# EAGLE design RB1_v2 (EAGLE 6.5.0)
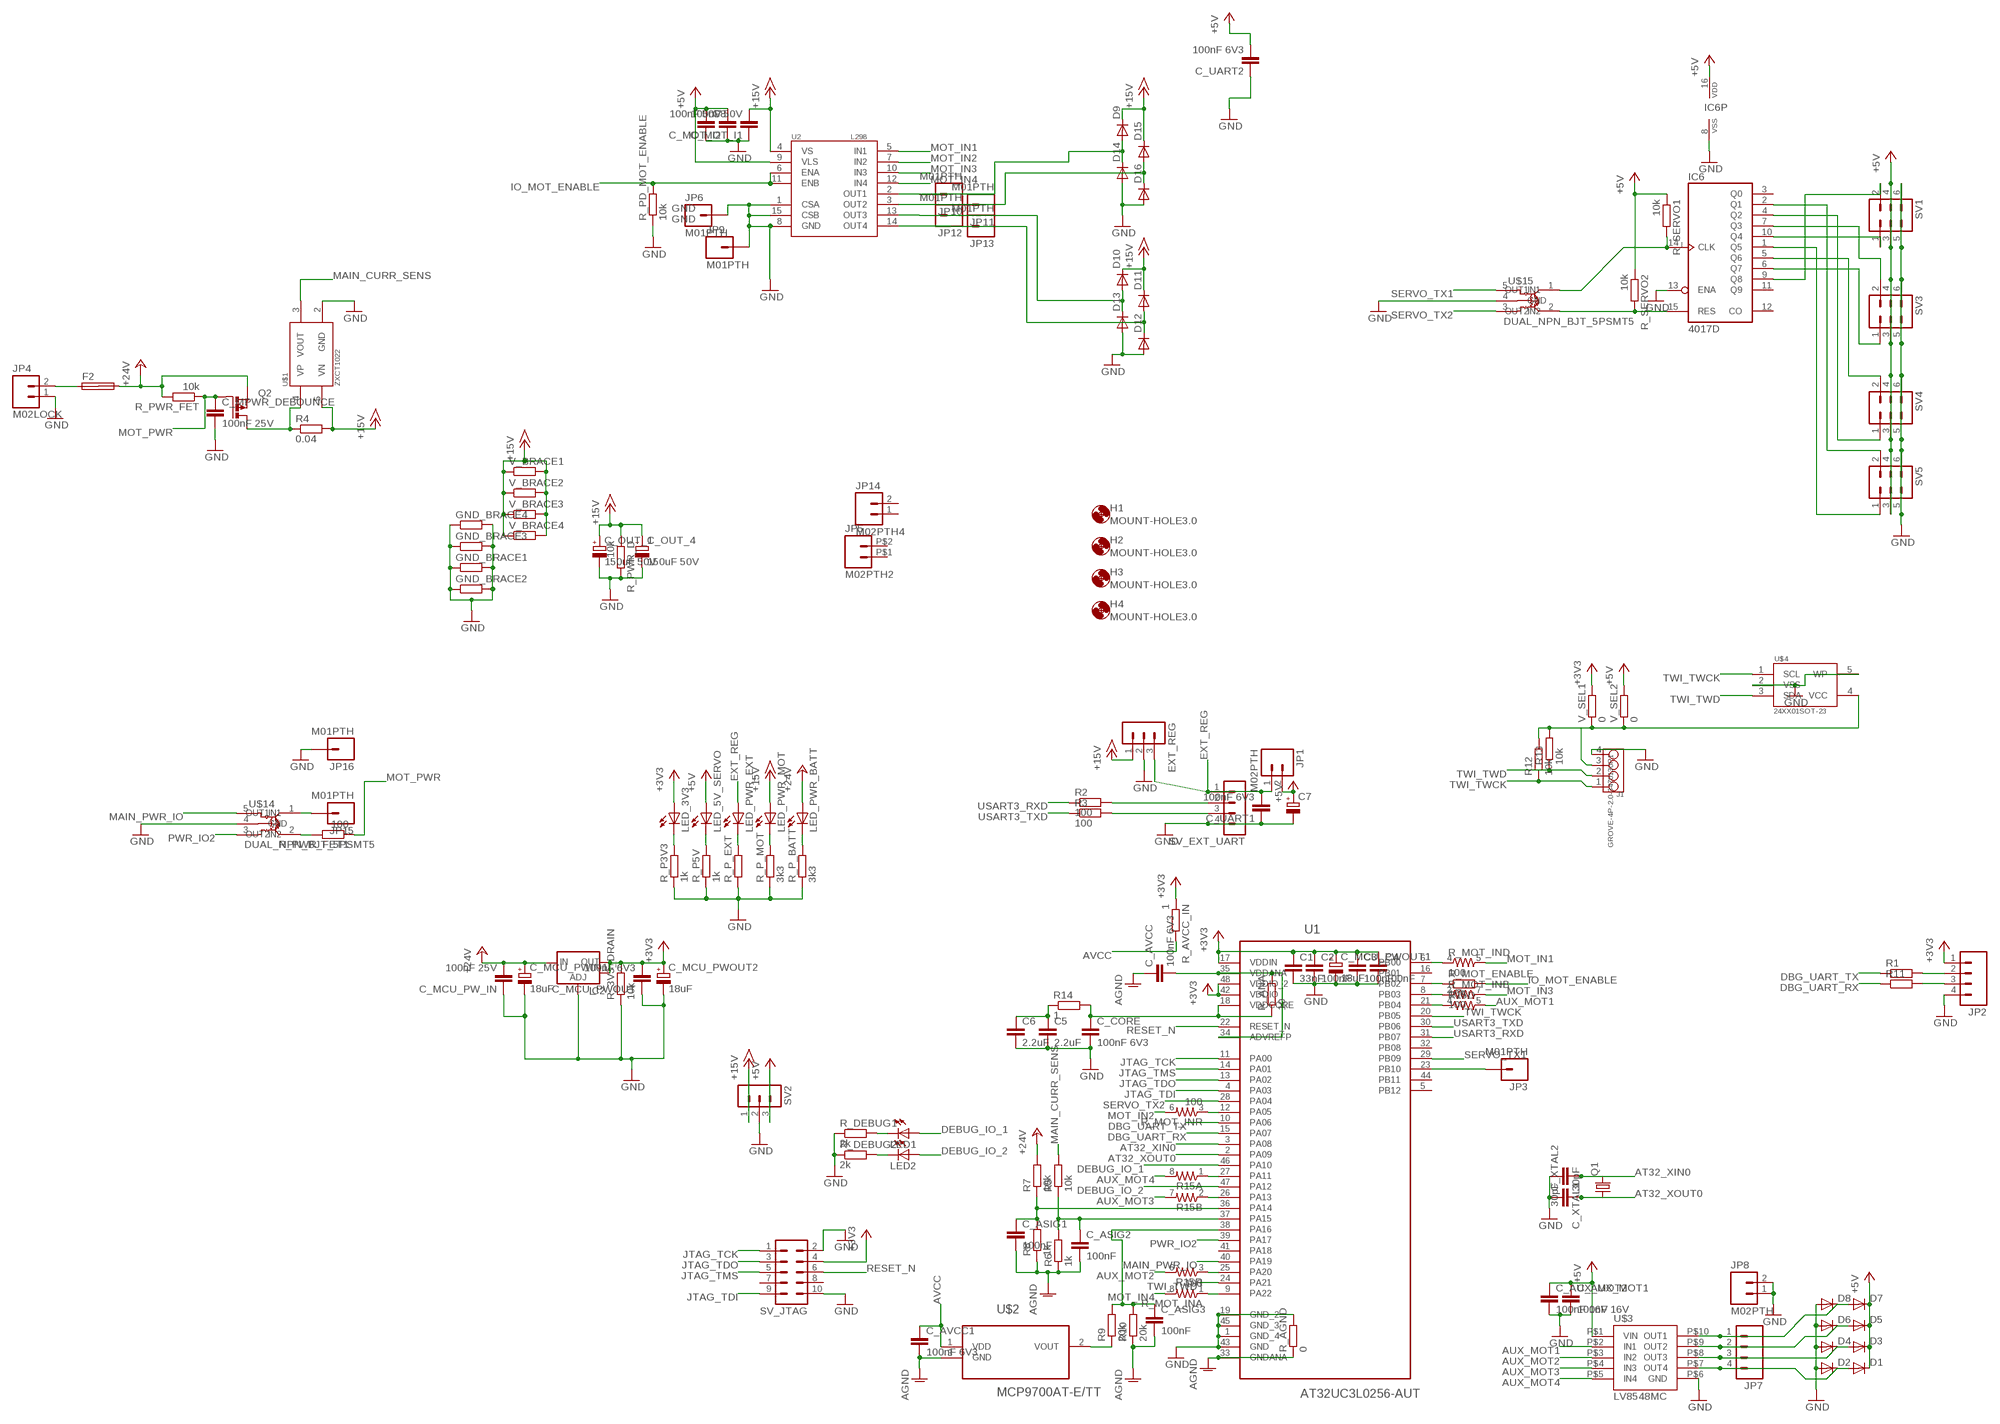
[diagram p0: schematic, sheet 1]

## Parts
C1  33nF  C-EUC0603K  [C0603K]
C2  100nF  C-EUC0603K  [C0603K]
C3  100nF  C-EUC0603K  [C0603K]
C4  100nF  C-EUC0603K  [C0603K]
C5  2.2uF  C-EUC0603K  [C0603K]
C6  2.2uF  C-EUC0603K  [C0603K]
C7  CPOL-EU153CLV-0807  [153CLV-0807]
C8  C-EUC1210K  [C1210K]
C_ASIG1  100nF  C-EUC0603K  [C0603K]
C_ASIG2  100nF  C-EUC0603K  [C0603K]
C_ASIG3  100nF  C-EUC0603K  [C0603K]
C_AUX_MOT1  100nF 16V  C-EUC0603K  [C0603K]
C_AUX_MOT2  100nF 16V  C-EUC0603K  [C0603K]
C_AVCC  100nF 6V3  C-EUC0603K  [C0603K]
C_AVCC1  100nF 6V3  C-EUC0603K  [C0603K]
C_CORE  100nF 6V3  C-EUC0603K  [C0603K]
C_MCU_PW_IN  100nF 25V  C-EUC0603K  [C0603K]
C_MCU_PWIN1  18uF  CPOL-EUE2-5  [E2-5]
C_MCU_PWOUT  100nF 6V3  C-EUC0603K  [C0603K]
C_MCU_PWOUT1  18uF  CPOL-EUE2-5  [E2-5]
C_MCU_PWOUT2  18uF  CPOL-EUE2-5  [E2-5]
C_MOT_I1  100nF 50V  C-EUC0603K  [C0603K]
C_MOT_I2  100nF 50V  C-EUC0603K  [C0603K]
C_MPWR_DEBOUNCE  100nF 25V  C-EUC0603K  [C0603K]
C_OUT_1  150uF 50V  CPOL-EUE5-10.5  [E5-10,5]
C_OUT_4  150uF 50V  CPOL-EUE5-10.5  [E5-10,5]
C_UART1  100nF 6V3  C-EUC0603K  [C0603K]
C_UART2  100nF 6V3  C-EUC0603K  [C0603K]
C_XTAL1  30pF  C-EUC0603K  [C0603K]
C_XTAL2  30pF  C-EUC0603K  [C0603K]
D1  DIODE-SOD123  [SOD123]
D2  DIODE-SOD123  [SOD123]
D3  DIODE-SOD123  [SOD123]
D4  DIODE-SOD123  [SOD123]
D5  DIODE-SOD123  [SOD123]
D6  DIODE-SOD123  [SOD123]
D7  DIODE-SOD123  [SOD123]
D8  DIODE-SOD123  [SOD123]
D9  DIODE-SOD123  [SOD123]
D10  DIODE-SOD123  [SOD123]
D11  DIODE-SOD123  [SOD123]
D12  DIODE-SOD123  [SOD123]
D13  DIODE-SOD123  [SOD123]
D14  DIODE-SOD123  [SOD123]
D15  DIODE-SOD123  [SOD123]
D16  DIODE-SOD123  [SOD123]
EXT_REG  MA03-1  [MA03-1]
F2  SHK20Q  [SHK20Q]
GND_BRACE1  R-EU_0204/2V  [0204V]
GND_BRACE2  R-EU_0204/2V  [0204V]
GND_BRACE3  R-EU_0204/2V  [0204V]
GND_BRACE4  R-EU_0204/2V  [0204V]
H1  MOUNT-HOLE3.0  [3,0]
H2  MOUNT-HOLE3.0  [3,0]
H3  MOUNT-HOLE3.0  [3,0]
H4  MOUNT-HOLE3.0  [3,0]
IC2  V_REG_LM1117SOT223  [SOT223]
IC6  4017D  [SO16]
J1  GROVE-4P-2.0-3470130P1  [4P-2.0]
JP1  M02PTH  [1X02]
JP2  M04PTH  [1X04]
JP3  M01PTH  [1X01]
JP4  M02LOCK  [1X02_LOCK]
JP5  M02PTH2  [1X02_BIG]
JP6  M01PTH  [1X01]
JP7  M04PTH  [1X04]
JP8  M02PTH  [1X02]
JP9  M01PTH  [1X01]
JP10  M01PTH  [1X01]
JP11  M01PTH  [1X01]
JP12  M01PTH  [1X01]
JP13  M01PTH  [1X01]
JP14  M02PTH4  [1X02_XTRA_BIG]
JP15  M01PTH  [1X01]
JP16  M01PTH  [1X01]
LED1  LEDCHIPLED_0603  [CHIPLED_0603]
LED2  LEDCHIPLED_0603  [CHIPLED_0603]
LED_3V3  LEDSML0603  [SML0603]
LED_5V_SERVO  LEDSML0603  [SML0603]
LED_PWR_BATT  LEDSML0603  [SML0603]
LED_PWR_EXT  LEDSML0603  [SML0603]
LED_PWR_MOT  LEDSML0603  [SML0603]
Q1  CRYSTALHC49S  [HC49/S]
Q2  P-MOSFET-SO8  [SO-08]
R1  R-EU_R0603  [R0603]
R2  100  R-EU_R0603  [R0603]
R3  100  R-EU_R0603  [R0603]
R4  0.04  R-EU_0617/17  [0617/17]
R5  10k  R-EU_R0603  [R0603]
R6  1k  R-EU_R0603  [R0603]
R7  10k  R-EU_R0603  [R0603]
R8  1k  R-EU_R0603  [R0603]
R9  20k  R-EU_R0603  [R0603]
R10  20k  R-EU_R0603  [R0603]
R11  R-EU_R0603  [R0603]
R12  10k  R-EU_R0603  [R0603]
R13  10k  R-EU_R0603  [R0603]
R14  1  R-EU_R0603  [R0603]
R15  RESISTOR-ARRAY0603-ARV  [0603-ARV]
R_3V3_DRAIN  10k  R-EU_R0603  [R0603]
R_AGND  0  R-EU_R0603  [R0603]
R_ANA  10  R-EU_R0603  [R0603]
R_AVCC_IN  1  R-EU_R0603  [R0603]
R_DEBUG1  2k  R-EU_R0603  [R0603]
R_DEBUG2  2k  R-EU_R0603  [R0603]
R_MOT_ENABLE  100  R-EU_R0603  [R0603]
R_MOT_IN  100  RESISTOR-ARRAY0603-ARV  [0603-ARV]
R_P3V3  1k  R-EU_R0603  [R0603]
R_P5V  1k  R-EU_R0603  [R0603]
R_P_BATT  3k3  R-EU_R0603  [R0603]
R_P_EXT  R-EU_R0603  [R0603]
R_P_MOT  3k3  R-EU_R0603  [R0603]
R_PD_MOT_ENABLE  10k  R-EU_R0603  [R0603]
R_PWR_D  10k  R-EU_R0603  [R0603]
R_PWR_FET  10k  R-EU_R0603  [R0603]
R_PWR_FET1  100  R-EU_R0603  [R0603]
R_SERVO1  10k  R-EU_R0603  [R0603]
R_SERVO2  10k  R-EU_R0603  [R0603]
SV1  MA03-2  [MA03-2]
SV2  MA03-1  [MA03-1]
SV3  MA03-2  [MA03-2]
SV4  MA03-2  [MA03-2]
SV5  MA03-2  [MA03-2]
SV_EXT_UART  MA04-1  [MA04-1]
SV_JTAG  MA05-2  [MA05-2]
U1  AT32UC3L0256-AUT  [QFP50P900X900X120-48N]
U2  L298  [MULTIWATT15]
U$1  ZXCT1022  [SOT23-5]
U$2  MCP9700AT-E/TT  [SOT95P237X112-3N]
U$3  LV8548MC  [SOIC10]
U$4  24XX01SOT-23  [SOT23-5L]
U$14  DUAL_NPN_BJT_5PSMT5  [SC-74A]
U$15  DUAL_NPN_BJT_5PSMT5  [SC-74A]
V_BRACE1  R-EU_0204/2V  [0204V]
V_BRACE2  R-EU_0204/2V  [0204V]
V_BRACE3  R-EU_0204/2V  [0204V]
V_BRACE4  R-EU_0204/2V  [0204V]
V_SEL1  0  R-EU_R0603  [R0603]
V_SEL2  0  R-EU_R0603  [R0603]

## Nets
+3V3: C1.1 C2.1 C3.1 C4.1 C_MCU_PWOUT1.+ C_MCU_PWOUT2.+ C_MCU_PWOUT.2 IC2.2(OUT) IC2.4(OUT) JP2.1 LED_3V3.A R_3V3_DRAIN.2 R_AVCC_IN.1 SV_JTAG.4 U1.17(VDDIN) U1.42(VDDIO) U1.48(VDDIO_2) V_SEL1.2
+5V: C7.+ C8.1 C_AUX_MOT1.1 C_AUX_MOT2.1 C_MOT_I2.2 C_UART2.2 D1.C D3.C D5.C D7.C IC6.16(VDD) JP1.2 LED_5V_SERVO.A R_SERVO1.1 R_SERVO2.1 SV1.3 SV1.4 SV2.3 SV3.3 SV3.4 SV4.3 SV4.4 SV5.3 SV5.4 U2.9(VLS) U$3.P$1(VIN) V_SEL2.2
+15V: C_MOT_I1.2 C_OUT_1.+ C_OUT_4.+ D9.C D10.C D11.C D15.C EXT_REG.1 LED_PWR_MOT.A R4.2 R_PWR_D.1 SV2.1 U2.4(VS) U$1.5(VN) V_BRACE1.1 V_BRACE1.2 V_BRACE2.1 V_BRACE2.2 V_BRACE3.1 V_BRACE3.2 V_BRACE4.1 V_BRACE4.2
+24V: C_MCU_PW_IN.2 C_MCU_PWIN1.+ F2.2A IC2.3(IN) LED_PWR_BATT.A Q2.1(S) Q2.2(S) Q2.3(S) R7.2 R_PWR_FET.2
AGND: C_ASIG1.2 C_ASIG2.2 C_ASIG3.2 C_AVCC1.2 C_AVCC.1 R6.1 R8.1 R10.1 R_AGND.1 U1.33(GNDANA) U$2.3(GND)
AT32_XIN0: C_XTAL1.1 Q1.2 U1.3(PA08)
AT32_XOUT0: C_XTAL2.2 Q1.1 U1.2(PA09)
AUX_MOT1: R15.5 U$3.P$2(IN1)
AUX_MOT2: R15.6 U$3.P$3(IN2)
AUX_MOT3: R15.7 U$3.P$4(IN3)
AUX_MOT4: R15.8 U$3.P$5(IN4)
AVCC: C_AVCC1.1 R_AVCC_IN.2 U$2.1(VDD)
BATT_VOLT_SENS: Q2.5(D) Q2.6(D) Q2.7(D) Q2.8(D) R4.1 U$1.4(VP)
DBG_UART_RX: R11.1 U1.15(PA07)
DBG_UART_TX: R1.1 U1.10(PA06)
DEBUG_IO_1: LED1.A U1.46(PA10)
DEBUG_IO_2: LED2.A U1.47(PA12)
EXT_REG: C_UART1.2 EXT_REG.3 JP1.1 LED_PWR_EXT.A SV_EXT_UART.1
GND: C1.2 C2.2 C3.2 C4.2 C5.2 C6.2 C7.- C8.2 C_AUX_MOT1.2 C_AUX_MOT2.2 C_CORE.2 C_MCU_PW_IN.1 C_MCU_PWIN1.- C_MCU_PWOUT1.- C_MCU_PWOUT2.- C_MCU_PWOUT.1 C_MOT_I1.1 C_MOT_I2.1 C_MPWR_DEBOUNCE.2 C_OUT_1.- C_OUT_4.- C_UART1.1 C_UART2.1 C_XTAL1.2 C_XTAL2.1 D2.A D4.A D6.A D8.A D12.A D13.A D14.A D16.A EXT_REG.2 GND_BRACE1.1 GND_BRACE1.2 GND_BRACE2.1 GND_BRACE2.2 GND_BRACE3.1 GND_BRACE3.2 GND_BRACE4.1 GND_BRACE4.2 IC2.1(ADJ) IC6.8(VSS) IC6.13(ENA) J1.4 JP2.4 JP4.1 JP6.1 JP8.1 JP8.2 JP9.1 JP16.1 R_3V3_DRAIN.1 R_AGND.2 R_DEBUG1.1 R_DEBUG2.1 R_P3V3.1 R_P5V.1 R_P_BATT.1 R_P_EXT.1 R_P_MOT.1 R_PD_MOT_ENABLE.1 R_PWR_D.2 SV1.5 SV1.6 SV2.2 SV3.5 SV3.6 SV4.5 SV4.6 SV5.5 SV5.6 SV_EXT_UART.4 SV_JTAG.2 SV_JTAG.10 U1.1(GND_4) U1.19(GND_2) U1.43(GND) U1.45(GND_3) U2.1(CSA) U2.8(GND) U2.15(CSB) U$1.2(GND) U$3.P$6(GND) U$4.2(VSS) U$4.5(WP) U$14.4(GND) U$15.4(GND)
IO_MOT_ENABLE: R_MOT_ENABLE.2 R_PD_MOT_ENABLE.2 U2.6(ENA) U2.11(ENB)
JTAG_TCK: SV_JTAG.1 U1.11(PA00)
JTAG_TDI: SV_JTAG.9 U1.4(PA03)
JTAG_TDO: SV_JTAG.3 U1.13(PA02)
JTAG_TMS: SV_JTAG.5 U1.14(PA01)
MAIN_CURR_SENS: R5.2 U$1.3(VOUT)
MAIN_PWR_IO: U1.40(PA19) U$14.5(IN1)
MOT_IN1: R_MOT_IN.5 U2.5(IN1)
MOT_IN2: R_MOT_IN.6 U2.7(IN2)
MOT_IN3: R_MOT_IN.7 U2.10(IN3)
MOT_IN4: R_MOT_IN.8 U2.12(IN4)
MOT_O3_1: D11.A D12.C JP13.1 U2.14(OUT4)
MOT_O3_2: D10.A D13.C JP12.1 U2.13(OUT3)
MOT_O4_1: D15.A D16.C JP11.1 U2.3(OUT2)
MOT_O4_2: D9.A D14.C JP10.1 U2.2(OUT1)
MOT_PWR: C_MPWR_DEBOUNCE.1 Q2.4(G) R_PWR_FET1.1 R_PWR_FET.1
N$1: C_AVCC.2 R_ANA.2 U1.34(ADVREFP) U1.35(VDDANA)
N$2: R9.1 U$2.2(VOUT)
N$3: R_MOT_IN.4 U1.6(PB00)
N$4: R_MOT_IN.3 U1.12(PA05)
N$5: IC6.14(CLK) R_SERVO1.2 U$15.1(OUT1)
N$6: IC6.15(RES) R_SERVO2.2 U$15.2(OUT2)
N$7: R_PWR_FET1.2 U$14.2(OUT2)
N$8: R_MOT_IN.2 U1.8(PB03)
N$9: F2.1A JP4.2
N$10: J1.3 R12.2 R13.2 U$4.4(VCC) V_SEL1.1 V_SEL2.1
N$11: R_MOT_IN.1 U1.9(PA22)
N$12: LED_3V3.C R_P3V3.2
N$13: IC6.1(Q5) SV5.1
N$14: C5.1 C6.1 R14.1
N$15: IC6.2(Q1) SV5.2
N$16: C_ASIG3.1 R9.2 R10.2 U1.38(PA16)
N$17: IC6.4(Q2) SV4.1
N$18: D7.A D8.C JP7.1 U$3.P$10(OUT1)
N$19: IC6.5(Q6) SV4.2
N$20: LED_5V_SERVO.C R_P5V.2
N$21: LED_PWR_EXT.C R_P_EXT.2
N$22: LED_PWR_MOT.C R_P_MOT.2
N$23: IC6.6(Q7) SV3.1
N$24: IC6.7(Q3) SV3.2
N$25: C_ASIG1.1 R7.1 R8.2 U1.36(PA14)
N$26: C_ASIG2.1 R5.1 R6.2 U1.37(PA15)
N$27: IC6.9(Q8) SV1.2
N$28: LED_PWR_BATT.C R_P_BATT.2
N$29: D5.A D6.C JP7.2 U$3.P$9(OUT2)
N$30: D3.A D4.C JP7.3 U$3.P$8(OUT3)
N$31: D1.A D2.C JP7.4 U$3.P$7(OUT4)
N$32: IC6.10(Q4) SV1.1
N$33: JP2.3 R11.2
N$34: JP2.2 R1.2
N$35: R_MOT_ENABLE.1 U1.7(PB02)
N$36: JP3.1 U1.23(PB10)
N$37: R15.4 U1.21(PB04)
N$38: R15.3 U1.25(PA20)
N$39: R15.2 U1.26(PA13)
N$40: R15.1 U1.27(PA11)
N$41: JP15.1 U$14.1(OUT1)
N$42: LED1.C R_DEBUG1.2
N$43: LED2.C R_DEBUG2.2
N$44: C_CORE.1 R14.2 R_ANA.1 U1.18(VDDCORE)
PWR_IO2: U1.39(PA17) U$14.3(IN2)
RESET_N: SV_JTAG.6 U1.22(RESET_N)
SERVO_TX1: U1.29(PB09) U$15.5(IN1)
SERVO_TX2: U1.28(PA04) U$15.3(IN2)
TWI_TWCK: J1.1 R12.1 U1.20(PB05) U$4.1(SCL)
TWI_TWD: J1.2 R13.1 U1.24(PA21) U$4.3(SDA)
USART3_RXD: R2.1 U1.31(PB07)
USART3_RXD_2: R2.2 SV_EXT_UART.2
USART3_TXD: R3.1 U1.30(PB06)
USART3_TXD_2: R3.2 SV_EXT_UART.3
Unconnected: F2.1B F2.2B IC6.3(Q0) IC6.11(Q9) IC6.12(CO) JP5.P$1 JP5.P$2 JP14.1 JP14.2 SV_JTAG.7 SV_JTAG.8 U1.5(PB12) U1.16(PB01) U1.32(PB08) U1.41(PA18) U1.44(PB11)

## Library data of the parts
C1-C6 C8 C_ASIG1-C_ASIG3 C_AUX_MOT1 C_AUX_MOT2 C_AVCC C_AVCC1 C_CORE C_MCU_PW_IN C_MCU_PWOUT C_MOT_I1 C_MOT_I2 C_MPWR_DEBOUNCE C_UART1 C_UART2 C_XTAL1 C_XTAL2 = resistor:C-EU: CAPACITOR, European symbol
C7 C_MCU_PWIN1 C_MCU_PWOUT1 C_MCU_PWOUT2 C_OUT_1 C_OUT_4 = resistor:CPOL-EU: POLARIZED CAPACITOR, European symbol
D1-D16 = diode:DIODE-: DIODE
EXT_REG SV2 = con-lstb:MA03-1: PIN HEADER; OC_FARNELL: unknown; OC_NEWARK: unknown
F2 = fuse:SHK20Q: FUSE HOLDER 5 x 20 mm, SH contact, E1207 Buerklin 64G6061; OC_FARNELL: unknown; OC_NEWARK: unknown
GND_BRACE1-GND_BRACE4 R1-R14 R_3V3_DRAIN R_AGND R_ANA R_AVCC_IN R_DEBUG1 R_DEBUG2 R_MOT_ENABLE R_P3V3 R_P5V R_P_BATT R_P_EXT R_P_MOT R_PD_MOT_ENABLE R_PWR_D R_PWR_FET R_PWR_FET1 R_SERVO1 R_SERVO2 V_BRACE1-V_BRACE4 V_SEL1 V_SEL2 = resistor:R-EU_: RESISTOR, European symbol
H1-H4 = holes:MOUNT-HOLE: MOUNTING HOLE with drill center marker
IC2 = SparkFun-PowerIC:V_REG_LM1117: Voltage Regulator LM1117 Standard adjustable voltage regulator but in SMD form. Spark Fun Electronics SKU : COM-00595
IC6 = 40xx:4017: COUNTER/DIVIDER
J1 = OPLEagle:GROVE-4P-2.0
JP1 JP4 JP5 JP8 JP14 = SparkFun-Connectors:M02: Standard 2-pin 0.1" header. Use with - straight break away headers ( PRT-00116) - right angle break away headers (PRT-00553) - swiss pins (PRT-00743) - machine pins (PRT-00117) - female headers (PRT-00115) Molex polarized connector foot print use with: PRT-08233 with associated crimp pins and housings. 2.54_SCREWTERM for use with PRT-10571. 3.5mm Screw Terminal footprints for PRT-08084 5mm Screw Terminal footprints for use with PRT-08433
JP2 JP7 = SparkFun-Connectors:M04: Header 4 Standard 4-pin 0.1" header. Use with straight break away headers (SKU : PRT-00116), right angle break away headers (PRT-00553), swiss pins (PRT-00743), machine pins (PRT-00117), and female headers (PRT-00115). Molex polarized connector foot print use with SKU : PRT-08231 with associated crimp pins and housings. 1MM SMD Version SKU: PRT-10208
JP3 JP6 JP9-JP13 JP15 JP16 = SparkFun-Connectors:M01: Header 1 Standard 1-pin 0.1" header. Use with straight break away headers (SKU : PRT-00116), right angle break away headers (PRT-00553), swiss pins (PRT-00743), machine pins (PRT-00117), and female headers (PRT-00115).
LED1 LED2 LED_3V3 LED_5V_SERVO LED_PWR_BATT LED_PWR_EXT LED_PWR_MOT = led:LED: LED OSRAM: - CHIPLED LG R971, LG N971, LY N971, LG Q971, LY Q971, LO R971, LY R971 LH N974, LH R974 LS Q976, LO Q976, LY Q976 LO Q996 - Hyper CHIPLED LW Q18S LB Q993, LB Q99A, LB R99A - SideLED LS A670, LO A670, LY A670, LG A670, LP A670 LB A673, LV A673, LT A673, LW A673 LH A674 LY A675 LS A676, LA A676, LO A676, LY A676, LW A676 LS A679, LY A679, LG A679 - Hyper Micro SIDELED® LS Y876, LA Y876, LO Y876, LY Y876 LT Y87S - SmartLED LW L88C, LW L88S LB L89C, LB L89S, LG L890 LS L89K, LO L89K, LY L89K LS L896, LA L896, LO L896, LY L896 - TOPLED LS T670, LO T670, LY T670, LG T670, LP T670 LSG T670, LSP T670, LSY T670, LOP T670, LYG T670 LG T671, LOG T671, LSG T671 LB T673, LV T673, LT T673, LW T673 LH T674 LS T676, LA T676, LO T676, LY T676, LB T676, LH T676, LSB T676, LW T676 LB T67C, LV T67C, LT T67C, LS T67K, LO T67K, LY T67K, LW E67C LS E67B, LA E67B, LO E67B, LY E67B, LB E67C, LV E67C, LT E67C LW T67C LS T679, LY T679, LG T679 LS T770, LO T770, LY T770, LG T770, LP T770 LB T773, LV T773, LT T773, LW T773 LH T774 LS E675, LA E675, LY E675, LS T675 LS T776, LA T776, LO T776, LY T776, LB T776 LHGB T686 LT T68C, LB T68C - Hyper Mini TOPLED® LB M676 - Mini TOPLED Santana® LG M470 LS M47K, LO M47K, LY M47K Source: http://www.osram.convergy.de LUXEON: - LUMILED® LXK2-PW12-R00, LXK2-PW12-S00, LXK2-PW14-U00, LXK2-PW14-V00 LXK2-PM12-R00, LXK2-PM12-S00, LXK2-PM14-U00 LXK2-PE12-Q00, LXK2-PE12-R00, LXK2-PE12-S00, LXK2-PE14-T00, LXK2-PE14-U00 LXK2-PB12-K00, LXK2-PB12-L00, LXK2-PB12-M00, LXK2-PB14-N00, LXK2-PB14-P00, LXK2-PB14-Q00 LXK2-PR12-L00, LXK2-PR12-M00, LXK2-PR14-Q00, LXK2-PR14-R00 LXK2-PD12-Q00, LXK2-PD12-R00, LXK2-PD12-S00 LXK2-PH12-R00, LXK2-PH12-S00 LXK2-PL12-P00, LXK2-PL12-Q00, LXK2-PL12-R00 Source: www.luxeon.com KINGBRIGHT: KA-3528ASYC Source: www.kingbright.com
Q1 = crystal:CRYSTAL: CRYSTAL; OC_FARNELL: 1667008; OC_NEWARK: unknown
Q2 = transistor-power:P-MOSFET-SO8: P-Channel MOSFET Example: FDS4435A; P-Channel Logic Level PowerTrench® MOSFET FDS4465; P-Channel 1.8V Specified PowerTrench® MOSFET Source: www.fairchildsemi.com
R15 R_MOT_IN = SparkFun-Resistors:RESISTOR-ARRAY: Array Chip Resistor Source: RS Component / Phycomp
SV1 SV3-SV5 = con-lstb:MA03-2: PIN HEADER; OC_FARNELL: unknown; OC_NEWARK: unknown
SV_EXT_UART = con-lstb:MA04-1: PIN HEADER; OC_FARNELL: unknown; OC_NEWARK: unknown
SV_JTAG = con-lstb:MA05-2: PIN HEADER; OC_FARNELL: unknown; OC_NEWARK: unknown
U1 = jmsSwitches:AT32UC3L0256-AUT: MCU, 32BIT, 128K FLASH, TQFP-48; MPN: AT32UC3L0256-AUT; OC_FARNELL: 1972037; OC_NEWARK: 68T4614; PACKAGE: TQFP-48; SUPPLIER: ATMEL
U2 = SparkFun-PowerIC:L298: L298 Dual Full Bridge Driver
U$1 = jmsSwitches:ZXCT1022: High-side current sensor. Needs a resistor, e.g. 0.05Ohm. Out = 100 x VP - VN
U$2 = jmsSwitches:MCP9700AT-E/TT: Low-Power Linear Active Thermistor; MPN: MCP9700AT-E/TT; OC_FARNELL: 1605577; OC_NEWARK: 84R5199; PACKAGE: SOT-3; SUPPLIER: MICROCHIP
U$3 = jmsSwitches:LV8548MC: 1A Motor Driver
U$4 = jmsSwitches:24XX01: 1K I2C EEPROM by Microchip. Address is 1010xxx, where xxx is internal block address.
U$14 U$15 = jmsSwitches:DUAL_NPN_BJT_5P

## Board
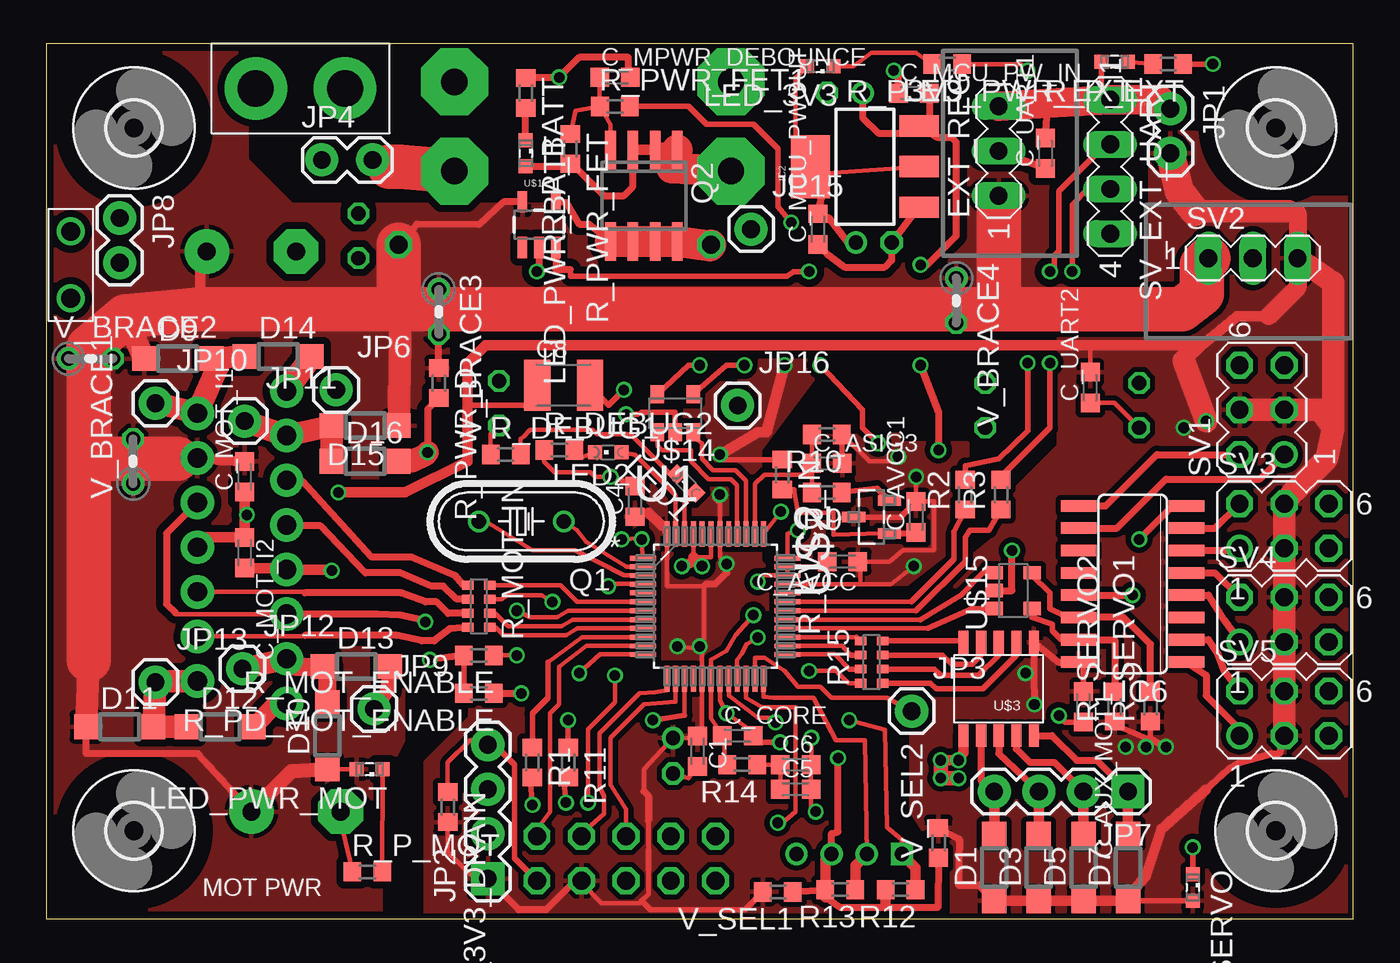
[diagram p1: board, top side]
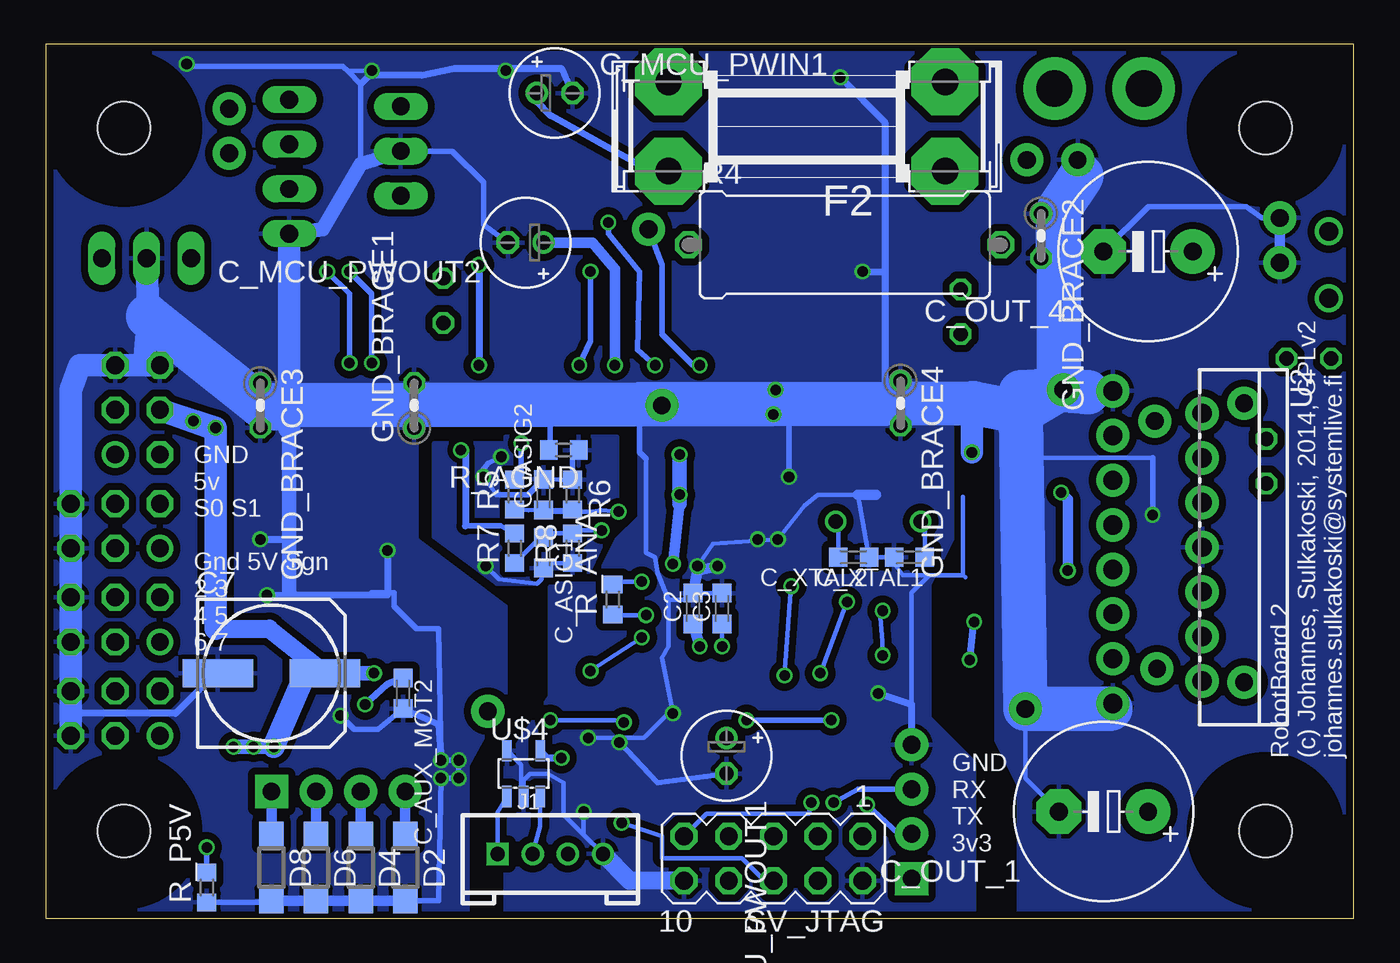
[diagram p2: board, bottom side, seen from below]

Size 74.42 x 49.78 mm. Coordinates in mm from the lower left corner, seen from the top.
Outline: 0,0 74.42,0 74.42,49.78 0,49.78 0,0
Copper layers (1*2*15*16): Top 0.035mm / dielectric 0.2mm / layer 2 0.0175mm / dielectric 1.1mm / layer 15 0.0175mm / dielectric 0.2mm / Bottom 0.035mm
Design rules "SeeedStudio_DRU_no_angle_20130527": minimum track width 6mil, minimum drill 12mil, track to track 6mil, track to pad 6mil, pad to pad 6mil, via to via 6mil, smd to smd 0mil, copper to edge 10mil, drill to drill 10mil, minimum pad ring 6mil, minimum via ring 6mil, stop-mask expansion 2mil, vias tented up to drill 25mil, thermal gap 10mil

### Footprints (pad centres in the part's own frame; a part is rotated, then mirrored left to right if it is on the bottom)
C0603K = smd 1.05 x 1.08: 1 -0.875,0; 2 0.875,0
153CLV-0807 = smd 4 x 1.6: + 3.05,0; - -3.05,0
C1210K = smd 1.5 x 2.9: 1 -1.5,0; 2 1.5,0
E2-5 = drill 0.813 pad 1.27: + -1.016,0 | drill 0.813 pad 1.27 octagon: - 1.016,0
E5-10,5 = drill 1.016 pad 2.54: + -2.54,0 | drill 1.016 pad 2.54 octagon: - 2.54,0
SOD123 = smd 1.4 x 1.4: A 1.9,0; C -1.9,0
MA03-1 = drill 1.016 long: 1 -2.54,0; 2 0,0; 3 2.54,0
SHK20Q = drill 1.5 pad 3.81 octagon: 1A -7.874,2.54; 1B -7.874,-2.54; 2A 7.874,2.54; 2B 7.874,-2.54
0204V = drill 0.813 octagon: 1 -1.27,0; 2 1.27,0
3,0 = hole 3: 0,0
SOT223 = smd 1.219 x 2.235: 1 -2.311,-3.099; 2 0,-3.099; 3 2.311,-3.099 | smd 3.6 x 2.2: 4 0,3.099
SO16 = smd 0.66 x 2.032: 1 -4.445,-3.073; 2 -3.175,-3.073; 3 -1.905,-3.073; 4 -0.635,-3.073; 5 0.635,-3.073; 6 1.905,-3.073; 7 3.175,-3.073; 8 4.445,-3.073; 9 4.445,3.073; 10 3.175,3.073; 11 1.905,3.073; 12 0.635,3.073; 13 -0.635,3.073; 14 -1.905,3.073; 15 -3.175,3.073; 16 -4.445,3.073
4P-2.0 = drill 0.8 pad 1.27 square: 1 -3,0 | drill 0.8 pad 1.27: 2 -1,0; 3 1,0; 4 3,0
1X02 = drill 1.016 pad 1.88: 1 0,0; 2 2.54,0
1X04 = drill 1.016 pad 1.88 square: 1 0,0 | drill 1.016 pad 1.88: 2 2.54,0; 3 5.08,0; 4 7.62,0
1X01 = drill 1.016 pad 1.88: 1 0,0
1X02_LOCK = drill 1.016 pad 1.88: 1 -0.178,0; 2 2.718,0
1X02_BIG = drill 1.067: P$1 0,0; P$2 3.81,0
1X02_XTRA_BIG = drill 2.057 pad 3.556: 1 -2.54,0; 2 2.54,0
CHIPLED_0603 = smd 0.8 x 0.8: A 0,-0.75; C 0,0.75
SML0603 = smd 0.8 x 0.8: A 0.75,0; C -0.75,0
HC49/S = drill 0.813: 1 -2.413,0; 2 2.413,0
SO-08 = smd 0.6 x 2.2: 1 -1.905,-2.6; 2 -0.635,-2.6; 3 0.635,-2.6; 4 1.905,-2.6; 5 1.905,2.6; 6 0.635,2.6; 7 -0.635,2.6; 8 -1.905,2.6
R0603 = smd 1 x 1.1: 1 -0.85,0; 2 0.85,0
0617/17 = drill 1.016 octagon: 1 -8.89,0; 2 8.89,0
0603-ARV = smd 0.5 x 0.65: 1 -1.2,-0.625; 2 -0.4,-0.625; 3 0.4,-0.625; 4 1.2,-0.625; 5 1.2,0.625; 6 0.4,0.625; 7 -0.4,0.625; 8 -1.2,0.625
MA03-2 = drill 1.016: 1 -2.54,-1.27 | drill 1.016 octagon: 2 -2.54,1.27; 3 0,-1.27; 4 0,1.27; 5 2.54,-1.27; 6 2.54,1.27
MA04-1 = drill 1.016 long: 1 -3.81,0; 2 -1.27,0; 3 1.27,0; 4 3.81,0
MA05-2 = drill 1.016 octagon: 1 -5.08,-1.27; 2 -5.08,1.27; 3 -2.54,-1.27; 4 -2.54,1.27; 5 0,-1.27; 6 0,1.27; 7 2.54,-1.27; 8 2.54,1.27; 9 5.08,-1.27; 10 5.08,1.27
QFP50P900X900X120-48N = smd 1.473 x 0.279: 1 -4.115,2.743; 2 -4.115,2.261; 3 -4.115,1.753; 4 -4.115,1.245; 5 -4.115,0.762; 6 -4.115,0.254; 7 -4.115,-0.254; 8 -4.115,-0.762; 9 -4.115,-1.245; 10 -4.115,-1.753; 11 -4.115,-2.261; 12 -4.115,-2.743; 25 4.115,-2.743; 26 4.115,-2.261; 27 4.115,-1.753; 28 4.115,-1.245; 29 4.115,-0.762; 30 4.115,-0.254; 31 4.115,0.254; 32 4.115,0.762; 33 4.115,1.245; 34 4.115,1.753; 35 4.115,2.261; 36 4.115,2.743 | smd 0.279 x 1.473: 13 -2.743,-4.115; 14 -2.261,-4.115; 15 -1.753,-4.115; 16 -1.245,-4.115; 17 -0.762,-4.115; 18 -0.254,-4.115; 19 0.254,-4.115; 20 0.762,-4.115; 21 1.245,-4.115; 22 1.753,-4.115; 23 2.261,-4.115; 24 2.743,-4.115; 37 2.743,4.115; 38 2.261,4.115; 39 1.753,4.115; 40 1.245,4.115; 41 0.762,4.115; 42 0.254,4.115; 43 -0.254,4.115; 44 -0.762,4.115; 45 -1.245,4.115; 46 -1.753,4.115; 47 -2.261,4.115; 48 -2.743,4.115
MULTIWATT15 = drill 1.1 pad 1.9: 1 -8.95,-2.39; 2 -7.68,2.69; 3 -6.41,-2.39; 4 -5.14,2.69; 5 -3.87,-2.39; 6 -2.6,2.69; 7 -1.33,-2.39; 8 -0.06,2.69; 9 1.21,-2.39; 10 2.48,2.69; 11 3.75,-2.39; 12 5.02,2.69; 13 6.29,-2.39; 14 7.56,2.69; 15 8.83,-2.39
SOT23-5 = smd 0.55 x 1.2: 1 -0.95,-1.3; 2 0,-1.3; 3 0.95,-1.3; 4 0.95,1.3; 5 -0.95,1.3
SOT95P237X112-3N = smd 0.584 x 1.321: 1 -0.94,-1.016; 2 0.94,-1.016; 3 0,1.016
SOIC10 = smd 0.579 x 1.3: P$1 -2,-2.659; P$2 -1,-2.659; P$3 0,-2.659; P$4 1,-2.659; P$5 2,-2.659; P$6 2,2.659; P$7 1,2.659; P$8 0,2.659; P$9 -1,2.659; P$10 -2,2.659
SOT23-5L = smd 0.55 x 1.2: 1 -0.95,-1.3; 2 0,-1.3; 3 0.95,-1.3; 4 0.95,1.3; 5 -0.95,1.3
SC-74A = smd 0.762 x 1.016: 1 2.032,0; 2 0,0; 3 0,2.159; 4 1.016,2.159; 5 2.032,2.159

### Placement (x,y rotation side)
C1  37.08,9.53 270 top
C2  37.59,17.65 90 bottom
C3  35.94,17.65 90 bottom
C4  33.53,23.75 90 top
C5  42.67,7.37 0 top
C6  42.67,8.76 0 top
C7  61.59,13.97 0 bottom
C8  29.46,30.35 0 top
C_ASIG1  46.1,20.83 270 bottom
C_ASIG2  46.1,24.13 90 bottom
C_ASIG3  44.45,25.91 0 top
C_AUX_MOT1  59.05,12.06 270 top
C_AUX_MOT2  54.1,12.83 270 bottom
C_AVCC  45.34,20.32 180 top
C_AVCC1  49.53,22.86 90 top
C_CORE  39.37,10.41 0 top
C_MCU_PW_IN  49.4,46.99 0 top
C_MCU_PWIN1  45.47,46.99 0 bottom
C_MCU_PWOUT  43.94,39.24 90 top
C_MCU_PWOUT1  35.69,9.27 270 bottom
C_MCU_PWOUT2  47.12,38.48 180 bottom
C_MOT_I1  11.3,25.15 90 top
C_MOT_I2  11.3,20.83 270 top
C_MPWR_DEBOUNCE  32.38,47.88 0 top
C_OUT_1  14.22,6.1 180 bottom
C_OUT_4  11.68,37.97 180 bottom
C_UART1  56.9,43.56 90 top
C_UART2  59.44,30.23 90 top
C_XTAL1  25.27,20.57 180 bottom
C_XTAL2  28.45,20.57 180 bottom
D1  53.98,2.92 90 top
D2  53.98,2.92 270 bottom
D3  56.52,2.92 90 top
D4  56.52,2.92 270 bottom
D5  59.05,2.92 90 top
D6  59.05,2.92 270 bottom
D7  61.59,2.92 90 top
D8  61.59,2.92 270 bottom
D9  7.49,31.88 0 top
D10  16,10.41 90 top
D11  4.19,10.92 0 top
D12  9.91,10.92 0 top
D13  17.65,14.35 0 top
D14  13.21,32 0 top
D15  18.16,28.07 180 top
D16  18.16,26.04 0 top
EXT_REG  54.23,43.69 90 top
F2  31.11,45.09 180 bottom
GND_BRACE1  53.47,29.21 90 bottom
GND_BRACE2  17.78,38.86 270 bottom
GND_BRACE3  62.23,29.21 270 bottom
GND_BRACE4  25.78,29.34 270 bottom
H1  5,45 0 top
H2  70,45 0 top
H3  70,5 0 top
H4  5,5 0 top
IC2  46.61,42.8 90 top
IC6  61.85,19.05 90 top
J1  45.72,3.68 0 bottom
JP1  64.01,46.1 270 top
JP2  25.15,2.29 90 top
JP3  49.28,11.81 0 top
JP4  15.88,43.18 0 top
JP5  1.4,35.31 90 top
JP6  16.51,30.1 0 top
JP7  61.59,7.24 180 top
JP8  4.19,39.88 270 top
JP9  18.67,11.94 0 top
JP10  6.22,29.34 0 top
JP11  11.3,28.32 0 top
JP12  11.18,14.22 0 top
JP13  6.22,13.46 0 top
JP14  14.48,47.24 0 top
JP15  40.13,39.24 0 top
JP16  39.37,29.21 0 top
LED1  36.45,24.77 45 top
LED2  32,26.54 90 top
LED_3V3  44.07,48.51 180 top
LED_5V_SERVO  65.28,1.78 270 top
LED_PWR_BATT  27.3,43.56 270 top
LED_PWR_EXT  60.83,48.77 180 top
LED_PWR_MOT  18.41,8.51 180 top
Q1  27.05,22.61 180 top
Q2  34.04,41.15 180 top
R1  27.69,8.89 270 top
R2  52.32,24.13 90 top
R3  54.36,24.13 90 top
R4  28.96,38.35 0 bottom
R5  47.75,24.13 90 bottom
R6  44.45,24.13 270 bottom
R7  47.75,21.08 90 bottom
R8  44.45,21.08 90 bottom
R9  44.45,24.26 180 top
R10  44.45,27.56 180 top
R11  29.72,8.89 270 top
R12  48.64,1.65 180 top
R13  45.21,1.65 180 top
R14  39.62,8.76 180 top
R15  46.99,14.61 270 top
R_3V3_DRAIN  22.86,6.35 270 top
R_AGND  44.96,26.67 180 bottom
R_ANA  42.16,18.16 90 bottom
R_AVCC_IN  41.91,25.27 270 top
R_DEBUG1  26.16,26.42 0 top
R_DEBUG2  29.21,26.67 0 top
R_MOT_ENABLE  24.64,14.99 180 top
R_MOT_IN  24.64,17.78 90 top
R_P3V3  51.31,48.64 180 top
R_P5V  65.28,1.78 90 bottom
R_P_BATT  27.3,46.99 270 top
R_P_EXT  63.88,48.64 180 top
R_P_MOT  18.29,2.67 0 top
R_PD_MOT_ENABLE  24.64,12.83 180 top
R_PWR_D  22.35,30.48 270 top
R_PWR_FET  29.84,43.81 270 top
R_PWR_FET1  32.38,46.23 0 top
R_SERVO1  62.87,12.06 90 top
R_SERVO2  60.83,12.06 90 top
SV1  69.22,28.96 90 top
SV2  68.71,37.59 0 top
SV3  70.48,22.35 0 top
SV4  70.48,17.02 0 top
SV5  70.48,11.68 0 top
SV_EXT_UART  60.58,42.8 270 top
SV_JTAG  33.02,3.43 180 bottom
U1  38.1,17.78 0 top
U2  11.3,21.08 270 bottom
U$1  28.07,39.5 0 top
U$2  46.99,22.86 90 top
U$3  54.23,13.08 180 top
U$4  47.24,8.26 0 bottom
U$14  36.83,29.84 180 top
U$15  56.13,17.65 90 top
V_BRACE1  4.95,26.04 90 top
V_BRACE2  2.54,31.88 0 top
V_BRACE3  22.35,34.54 270 top
V_BRACE4  51.82,35.18 270 top
V_SEL1  41.66,1.52 180 top
V_SEL2  50.8,4.32 90 top

### Tracks (layer width: path | path; a pad name or v marks a point on that pad's centre or on a via)
+3V3  (via drill 0.6)
  Top 0.254: 37.34,14.99 37.47,16 37.47,18.92 35.36,18.92 U1.48 35.26,21.89 35.05,22.35 | 37.34,14.99 U1.17 37.34,10.67 37.08,10.41 C1.1 36.46,10.27 C_MCU_PWOUT1.+ 34.04,8.51 34.04,7.24 | 37.08,15.37 37.34,14.99 | v35.94,15.49 37.08,15.37 | 37.08,15.37 v37.21,15.49 | IC2.2 44.46,42.42 IC2.4 43.51,43.61 42.67,44.45 42.67,47.87 LED_3V3.A | 38.04,23.94 38.35,23.62 U1.42 38.35,20.57 v38.73,20.19 | 34.29,5.59 34.29,3.94 | 34.29,2.79 34.29,1.4 33.91,1.02 33.78,0.89 31.62,0.89 30.48,2.03 SV_JTAG.4 | R_3V3_DRAIN.2 22.86,3.81 24.13,2.54 24.89,2.54 JP2.1
  Top 0.305: 34.29,3.94 34.29,2.79 | V_SEL1.2 39.79,0.51 34.42,0.51 33.91,1.02 | R_AVCC_IN.1 38.52,26.12 v38.35,26.42
  Top 0.406: 34.29,23.11 33.9,23.13 C4.1 | 37.47,18.92 37.59,19.05 38.1,19.05 38.73,19.68 v38.73,20.19 | 34.04,7.24 34.29,6.99 34.29,5.59 | SV_JTAG.4 30.1,2.16 28.45,0.51 26.92,0.51 JP2.1 | 44.46,42.42 C_MCU_PWOUT.2 44.05,39.88 44.58,39.88 45.97,38.1 C_MCU_PWOUT2.+
  Top 0.61: 35.05,22.35 34.29,23.11 | v38.35,26.42 40.51,27.69 41.02,27.69 v42.04,31.5
  Bottom 0.254: C3.1 v35.94,15.49
  Bottom 0.61: C2.1 v37.21,15.49 | 38.35,23.62 v38.73,20.19 | v42.04,31.5 42.04,36.96 43.31,38.48 C_MCU_PWOUT2.+
  Bottom 0.813: v38.35,26.42 v38.35,24.13 38.35,23.62
  pour Top (isolate 0.305): 21.59,0 21.59,8.89 24.13,11.43 24.13,19.05 33.02,19.05 33.02,25.4 25.4,26.67 25.4,30.48 39.37,30.48 40.64,31.75 44.45,31.75 40.64,26.67 40.64,20.32 43.18,17.78 46.99,17.78 46.99,11.43 48.26,10.16 48.26,0
+5V  (via drill 0.6)
  Top 0.254: C_UART2.2 59.44,32.38 59.69,32.64
  Top 0.305: LED_5V_SERVO.A 60.97,1.03 60.96,1.02 | v55.75,13.97 56.1,13.97 56.24,13.98 | C_AUX_MOT1.1 59.05,14.33 IC6.16 | R_SERVO1.1 62.87,10.29 v63.75,9.78 60.83,11.05 R_SERVO2.1 | C8.1 27.96,29.23 27.94,29.21 24,29.21
  Top 0.406: v56.26,12.19 56.24,13.98 56.23,14.57 U$3.P$1 57.62,14.61 IC6.16 | V_SEL2.2 51.98,4.53 51.94,1.91 53.09,1.91 D1.C | 66.03,7.35 67.31,8.51 67.94,8.89 69.72,9.4 70.23,9.4 SV5.3
  Top 0.61: D1.C D3.C D5.C 60.96,1.02 D7.C 61.59,1.27 62.61,2.41 63.5,5.08 66.03,7.35 | C_MOT_I2.2 13.61,19.95 U2.9 16.32,19.87 v16.26,19.81 | 69.6,34.29 67.82,34.29 65.79,32.64 | 65.79,32.64 59.69,32.64 25.02,32.64 24,31.62 24,29.21 24,26.04 20.45,24.26 v16.64,24.26 | 65.79,32.64 64.9,31.75 64.77,31.75
  Top 1.016: 69.6,34.29 71.25,35.94 SV2.3 71.25,40.13 70.74,40.26
  Top 1.27: SV1.4 SV1.3 72.52,28.96 73.28,27.94 | SV5.3 SV5.4 SV4.3 SV4.4 SV3.3 SV3.4 70.87,24.13 72.9,26.16 73.28,27.94 | SV2.3 73.28,36.2 73.28,27.94 | 64.77,31.75 v66.04,28.32 | 65.41,40.26 70.74,40.26
  Top 1.676: JP1.2 64.52,41.4 65.41,40.26
  Bottom 0.406: v56.26,12.19 55.01,13.34 C_AUX_MOT2.1 | 59.69,13.97 C7.+
  Bottom 0.61: v16.64,24.26 16.26,23.88 v16.26,19.81
  Bottom 0.813: 59.82,13.59 59.69,13.97 | C7.+ v55.75,13.97 | v63.75,9.78 v62.61,9.78 v61.47,9.78
  Bottom 1.016: 64.77,16.51 61.72,16.51 C7.+
  Bottom 1.27: v66.04,28.32 v64.77,27.94 SV1.4 64.77,27.81 64.77,16.51 | v61.47,9.78 59.82,13.59
  pour Top (isolate 0.305): 74.42,0 74.42,41.02 69.6,41.02 66.04,44.7 62.87,44.83 62.87,33.02 57.66,33.02 57.66,26.92 54.23,23.5 54.23,21.84 48.26,17.02 48.26,13.21 49.28,11.81 49.28,6.1 51.56,2.54 51.56,0.13 51.56,0
+15V
  Top 0.254: LED_PWR_MOT.A D10.C | 7.49,26.16 6.1,26.16 V_BRACE1.2 V_BRACE1.1 | V_BRACE2.2 2.67,31.88 2.54,31.75 2.54,32.59 2.74,32.79 | V_BRACE2.1 2.29,31.88 2.41,31.75
  Top 0.305: 54.23,34.67 51.82,34.67 V_BRACE4.2 V_BRACE4.1
  Top 0.406: U$1.5 26.04,40.8 24.64,39.5 21.11,39.53 R4.2 | C_OUT_1.+ 8.64,9.4 2.29,9.4 2.29,9.53 D11.C | R_PWR_D.1 V_BRACE3.2 | V_BRACE3.2 22.35,33.78 22.86,34.29 22.86,34.67 | 22.86,34.67 22.35,34.16 V_BRACE3.2 | 22.86,34.67 22.35,35.18 V_BRACE3.1 | 20.19,34.16 20.32,34.29 20.32,34.67
  Top 0.61: 54.23,40.64 53.72,40.64 EXT_REG.1 | C_MOT_I1.2 9.96,26.09 U2.4 | C_OUT_4.+ 8.76,37.59 8.76,34.67
  Top 0.813: 53.85,38.99 EXT_REG.1 | D10.C 13.97,8.39 C_OUT_1.+
  Top 1.27: U2.4 8.55,26.16 7.49,26.16 | D15.C 20.19,34.16 | D9.C 4.49,34.27 | D11.C 2.41,14.73
  Top 2.54: R4.2 20.07,34.67 | 20.07,34.67 20.32,34.67 22.86,34.67 54.23,34.67 | 54.23,34.67 54.23,40.64 | 20.07,34.67 8.76,34.67 4.57,34.29 4.49,34.27 2.74,32.79 2.41,32.51 2.41,31.75 2.41,26.16 | 2.41,26.16 2.41,14.73 | 7.49,26.16 2.41,26.16 | 54.23,34.67 64.64,34.67 65.79,35.56 65.79,37.21 SV2.1
  pour Top (isolate 0.406): 19.05,0 0,0 0,40.51 0.51,49.4 9.4,49.53 11.43,49.53 11.43,43.18 13.97,40.64 41.91,40.64 41.91,49.53 58.42,49.53 58.42,34.29 22.86,34.29 22.86,26.67 20.32,25.4 20.32,10.16 19.05,7.62
+24V  (via drill 0.6)
  Top 0.406: R_PWR_FET.2 29.97,43.18 | 29.97,43.18 29.97,42.93 31.75,41.15 32.89,41.15 33.4,41.66 Q2.3 | v49.78,31.5 50.8,28.83 v50.8,26.67 | LED_PWR_BATT.A 29.6,42.81 29.97,43.18 | C_MCU_PWIN1.+ 46.48,45.59 47.37,44.7 50.49,44.7 IC2.3 | C_MCU_PW_IN.2 50.28,44.92 IC2.3 | v49.78,37.21 50.16,37.21 51.82,38.86 51.82,44.2 51.56,44.45 50.75,44.45 IC2.3
  Top 0.61: Q2.3 Q2.2
  Top 0.813: Q2.2 Q2.1
  Top 1.778: Q2.1 35.63,42.73 F2.2A
  Bottom 0.305: 50.55,22.35 48.55,22.35 R7.2
  Bottom 0.406: v49.78,37.21 v49.78,31.5 | v50.8,26.67 50.55,26.67 50.55,22.35 | F2.2A 40.26,42.67 45.72,45.72 46.48,46.48 C_MCU_PWIN1.+
AGND  (via drill 0.6)
  Top 0.254: U1.33 46.35,19.02 | 46.35,19.02 48.11,19.02 v49.4,20.07 | 46.35,19.02 46.35,20.32 C_AVCC.1 48.01,20.32 48.77,20.95 50.55,20.95 50.55,23.75 49.92,23.75 49.92,24.13 | R10.1 46.86,26.04 48.26,26.04 v48.51,26.29 | v49.53,25.15 C_AVCC1.2
  Top 0.305: 49.92,24.13 C_AVCC1.2 48.64,22.86 U$2.3 | C_ASIG3.2 45.3,26.19 R10.1
  Bottom 0.254: C_ASIG2.2 45.19,24.98 R6.1 | v49.4,20.07 48.64,19.3 46.48,19.05 46.23,19.3 46.23,20.08 C_ASIG1.2 46.1,20.23 R8.1 | v48.51,26.29 49.28,25.91 | 48.77,24.13 v49.53,25.15
  Bottom 0.305: 49.28,25.91 49.66,25.4 v49.53,25.15 | 48.77,24.13 46.98,24.13 C_ASIG2.2 | R_AGND.1 44.45,26.33 R6.1
  pour Bottom (isolate 0.305): 41.91,26.67 41.91,22.73 42.67,21.59 43.56,19.68 46.48,19.68 46.48,19.05 48.77,19.05 52.32,21.72 52.32,27.05 48.26,27.05 48.26,27.43 41.91,27.43
  pour Top (isolate 0.305): 41.91,26.67 41.78,23.11 43.56,19.68 43.94,19.56 46.74,19.56 46.74,19.05 49.02,19.05 52.45,21.72 52.45,27.05 48.51,27.05 48.51,27.56 42.93,27.43 41.91,26.8
AT32_XIN0
  Top 0.254: U1.3 32.89,19.53 30.1,20.95 27.69,20.95 25.02,22.61 Q1.2
  Bottom 0.254: C_XTAL1.1 24.4,22.37 Q1.2
AT32_XOUT0
  Top 0.254: U1.2 33.05,20.04 30.73,21.46 30.23,22.1 Q1.1
  Bottom 0.254: C_XTAL2.2 29.32,22.11 Q1.1
AUX_MOT1
  Top 0.305: R15.5 50.35,13.4 50.67,13.08 53.34,13.08 55.24,14.99 55.24,15.63 U$3.P$2
AUX_MOT2
  Top 0.305: R15.6 50.56,14.21 50.93,13.84 53.09,13.84 54.23,14.99 U$3.P$3
AUX_MOT3
  Top 0.305: R15.7 51.03,15.01 51.56,14.48 52.7,14.48 53.21,14.99 53.21,15.72 U$3.P$4
AUX_MOT4
  Top 0.305: R15.8 52.1,15.8 U$3.P$5
AVCC
  Top 0.254: 42.58,24.42 42.8,23.11 44.83,23.11 44.83,21.86 C_AVCC1.1
  Top 0.305: 42.58,24.42 R_AVCC_IN.2 | C_AVCC1.1 49.47,21.92 U$2.1
BATT_VOLT_SENS
  Top 0.406: U$1.4 29.59,40.77 30.35,39.53 30.9,39.53 Q2.5
  Top 1.778: Q2.5 Q2.6 Q2.7 Q2.8 37.79,38.29 R4.1
DBG_UART_RX  (via drill 0.6)
  Top 0.254: U1.15 36.35,11.58
  Top 0.305: 36.35,11.58 v34.54,11.3 | R11.1 v29.72,11.3
  Bottom 0.305: v34.54,11.3 v29.72,11.3
DBG_UART_TX
  Top 0.254: U1.10 30.5,16.03 28.57,14.61
  Top 0.305: 28.57,14.61 28.57,12.57 27.69,11.68 R1.1
DEBUG_IO_1
  Top 0.254: U1.46 36.35,23.6 LED1.A
DEBUG_IO_2
  Top 0.254: U1.47 35.84,24.11 33.53,26.42 LED2.A
EXT_REG
  Top 0.305: SV_EXT_UART.1 60.08,47.1 LED_PWR_EXT.A
  Top 0.406: C_UART1.2 57.02,46.4
  Top 0.813: JP1.1 63.37,46.61
  Top 1.676: EXT_REG.3 57.02,46.4 SV_EXT_UART.1 63.37,46.61
GND  (via drill 0.6)
  Top 0.254: U1.1 33.86,21.64 | 33.86,21.64 v32.77,21.59 | U1.45 36.85,20.57 37.34,20.57 | U1.43 37.85,20.57 37.34,20.57 | U1.19 38.35,12.45 v38.73,11.68 39.99,10.81 C_CORE.2 | v43.56,10.29 43.56,8.78 C6.2 C5.2 43.55,6.11 v43.81,6.1 | C1.2 36.58,8 C_MCU_PWOUT1.- | v37.34,20.07 37.34,20.57 | 33.86,21.64 33.91,21.82 v33.91,21.59 | C_OUT_1.- 16.64,6.13 R_P_MOT.1 | R_DEBUG2.1 28.36,26 28.96,25.4 30.99,25.4 31.24,25.15 v32.13,25.15 | R_DEBUG1.1 25.31,27.6 GND_BRACE4.2 | R_P3V3.1 55.5,48.64 v55.88,48.26 | C_UART2.1 60.82,29.35 GND_BRACE3.2 | R_3V3_DRAIN.1 22.86,8.89 24.13,10.16 24.89,10.16 JP2.4
  Top 0.305: C_CORE.2 40.63,10.03 v41.78,10.03 | SV_JTAG.2 26.67,3.43 26.67,8.76 25.53,9.91 JP2.4 | R_P_EXT.1 v66.42,48.64 | C_AUX_MOT1.2 58.02,11.19 v57.66,11.56 | U$14.4 35.81,28.83 33.91,28.83 33.66,28.7 v33.02,28.7 | C4.2 33.66,24.64 v32.13,25.15 | C_MOT_I1.1 11.43,24.4 v11.43,22.99 | C8.2 32,29.21 v32.89,30.1
  Top 0.406: IC6.8 64.14,23.5 v62.23,21.59 | IC6.13 v61.85,18.41 | U$15.4 54.99,18.67 v54.99,20.95 | R_PD_MOT_ENABLE.1 v27.05,12.83 | C_UART1.1 EXT_REG.2 | R_PWR_D.2 21.72,29 v21.72,26.54 | R_P_BATT.1 27.34,47.88 v29.21,47.88 30.35,49.02 33.15,49.02 33.15,47.99 C_MPWR_DEBOUNCE.2 | U$1.2 28.07,36.96 v27.94,36.83 | IC2.1 49.25,39.98 C_MCU_PWOUT2.- 48.13,37.47 47.75,37.08 45.47,37.08 44.45,37.85 C_MCU_PWOUT.1 | C_MCU_PW_IN.1 48.53,47.99 v48.26,48.26
  Top 0.61: v36.2,20.07 36.85,20.32 36.85,20.57 | U$3.P$6 52.23,9.43 v51.94,9.02 v50.93,9.02 | U2.8 9.17,21.7 C_MOT_I2.1 C_MOT_I1.1
  Top 0.813: D13.A 19.43,12.96 JP9.1 | v50.93,9.02 v50.93,8 v51.94,8
  Top 1.016: D12.A 13.14,12.25 U2.15
  Top 1.27: D16.A 20.83,26.04 21.59,26.42 v21.72,26.54 | D14.A U2.1
  Bottom 0.254: 22.23,19.56 24.13,19.56 | 24.13,19.56 25.65,19.56 26.29,20.43 | 26.29,20.7 26.29,20.43 | 26.29,20.43 C_XTAL1.2 C_XTAL2.1 28.21,24.13 30.48,24.13 31.24,23.5 v32.77,21.59 36.45,21.34 v37.34,20.07 | 22.23,19.56 22.23,24 | v43.56,10.29 40.39,10.29 38.99,11.68 v38.73,11.68 39.37,14.86 38.99,15.49 39,18.15 | 39,18.15 38.99,18.15 38.73,18.16 37.85,18.16 37.85,18.66 C2.2 C3.2 | 39,18.15 39.62,19.68 39.77,20.56 40.26,20.83 40.26,26.16 | 22.23,19.56 22.1,19.43 | U$4.5 48.16,9.55 47.37,8.76 47.37,7.08 U$4.2 47.24,7.87 46.86,8.26 45.85,8.26 44.96,7.75 44.96,5.92 43.81,4.78 | v43.81,6.1 43.81,4.78 | 43.81,4.78 J1.4 | 11.43,26.23 18.89,26.23 | v55.88,48.26 57.15,48.26 57.21,48.2 | GND_BRACE1.1 53.47,29.11 53.34,29.23 53.34,30.35 GND_BRACE1.2 | JP2.4 25.15,18.54 24.13,19.56 | JP9.1 18.67,8 C_OUT_1.-
  Bottom 0.305: v41.78,10.03 39.62,7.75 C_MCU_PWOUT1.- | 40.26,26.16 40.64,26.54 40.64,29.21 | 40.64,29.21 40.64,29.27 | R_AGND.2 45.72,26.76 45.72,29.26 | v66.42,48.64 66.29,48.51 57.53,48.51 57.21,48.2 56.52,47.5 56.52,42.93 | R_P5V.1 61.69,0.93 D8.A | EXT_REG.2 51.31,43.69 49.53,41.91 49.53,39.5 C_MCU_PWOUT2.- | D2.A 52.07,1.02 v51.94,8 v50.93,8 v50.93,9.02 v51.94,9.02 52.07,16.51 53.34,16.51 54.61,17.78 54.61,18.54 55.88,18.54 55.88,18.41 | v57.66,11.56 56.9,10.79 55.51,10.79 C_AUX_MOT2.2 | 60.58,27.94 GND_BRACE3.2 62.23,29.21 GND_BRACE3.1 | v33.02,28.7 33.02,29.21 | 33.02,29.21 33.02,29.29 33.15,29.29 | GND_BRACE4.2 30.48,29.21 | 30.48,29.21 32.13,29.21 | 30.48,29.21 GND_BRACE4.1 | v32.13,25.15 32.13,29.21 | 32.13,29.21 33.02,29.21 | v11.43,22.99 11.43,26.23 | 18.89,26.23 18.89,26.65 | C_OUT_4.- 11.68,40.51 6.1,40.51 5.21,39.88 JP8.1 | JP16.1 40.64,29.21 | v32.89,30.1 32.89,29.34 33.02,29.21
  Bottom 0.406: C_AUX_MOT2.2 52.07,11.06 v51.94,9.02 | v62.23,21.59 60.58,21.59 | v61.85,18.41 60.71,18.41 | 60.71,18.41 60.58,18.54 | 15.11,30.03 15.18,30.1 JP6.1 | v54.99,20.95 54.99,18.41 55.88,18.41 60.71,18.41 | C7.- 65.28,13.46 67.06,11.68 73.03,11.68 | v27.05,12.83 25.15,12.19 JP2.4 | v29.21,47.88 26.67,45.34 26.67,36.83 | 26.67,36.83 26.67,29.31 | v27.94,36.83 26.67,36.83 | 48.26,48.39 51.18,48.39 53.09,48.01 56.01,48.01 56.52,47.5 | 48.26,48.39 45.09,48.39 C_MCU_PWIN1.- | v48.26,48.26 48.26,48.39
  Bottom 0.61: C2.2 37.34,19.81 v36.2,20.07 | JP8.1 JP8.2 | 28.21,24.13 27.18,24.13 | D2.A D4.A D6.A D8.A | C_OUT_4.- 14.73,38.48 GND_BRACE2.2 GND_BRACE2.1 17.4,40.77 16.76,40.39 | 15.49,42.29 17.09,40.69 JP4.1
  Bottom 0.813: 60.58,18.54 60.58,21.59 60.58,27.94 | SV_EXT_UART.4 58.67,39.24 56.52,42.93 EXT_REG.2
  Bottom 1.016: SV_JTAG.10 41.2,2.16 J1.4
  Bottom 1.27: 60.58,27.94 SV_EXT_UART.4 | SV5.5 73.03,11.68 SV5.6 SV4.5 SV4.6 SV3.5 SV3.6 73.03,30.1 72.52,31.5 SV1.5 SV1.6 68.83,31.62 68.61,34.28 SV2.2 | 13.84,11.94 15.11,12.25 U2.15 | 15.11,29.97 15.11,30.03 U2.1 | v21.72,26.54 21.72,29.32
  Bottom 2.54: 15.49,42.29 16.76,40.39 16.76,30.1 | 16.76,30.1 18.92,28.82 | 18.92,28.82 21.59,29.33 21.72,29.32 26.67,29.31 33.15,29.29 40.64,29.27 45.72,29.26 53.34,29.23 62.23,29.21 68.62,34.29 68.61,34.28 | 18.92,28.82 18.92,28.7 | 18.92,28.7 18.89,26.65 JP9.1 13.84,11.94 | 16.76,30.1 15.11,29.97 | 16.76,30.1 18.92,29.97 18.92,28.7
  pour Bottom (isolate 0.406): 0,0 0,40.51 0.51,49.4 9.4,49.66 74.42,49.78 74.42,0 51.31,-0.13 50.42,-0.13 50.42,8.76 48.26,12.7 48.26,17.78 53.34,21.59 53.34,29.21 40.64,29.21 40.64,22.86 41.91,21.59 43.18,19.05 45.72,19.05 45.72,12.7 48.26,8.89 48.26,0 21.59,0 21.59,8.89 24.13,11.43 24.13,19.05 22.86,21.59 22.86,29.21 20.32,29.21 20.32,10.16 19.05,7.62 19.05,0
IO_MOT_ENABLE  (via drill 0.6)
  Top 0.254: 7.37,17.4 7.43,17.33 U2.11
  Top 0.305: R_PD_MOT_ENABLE.2 R_MOT_ENABLE.2
  Top 0.406: R_MOT_ENABLE.2 v21.84,14.73 | v21.59,16.89 21.34,17.02 20.19,17.27 18.86,17.33 U2.11 | U2.6 6.86,21.93 6.86,17.91 7.37,17.4
  Bottom 0.406: v21.84,14.73 v21.59,16.89
JTAG_TCK
  Top 0.254: U1.11 30.76,15.52 29.21,14.35 29.21,12.19 28.7,11.68 28.7,6.1 27.94,5.08 SV_JTAG.1
JTAG_TDI  (via drill 0.6)
  Top 0.254: U1.4 33.96,19.05 32.13,19.05 v32,18.92 | v32.38,13.84 32.38,12.32 30.86,10.79 v30.86,6.6
  Bottom 0.254: v32,18.92 v32.38,13.84 | v30.86,6.6 30.99,5.97 36.83,5.97 SV_JTAG.9
JTAG_TDO
  Top 0.254: U1.13 35.36,13.01 34.67,12.88 33.78,12.83 31.5,10.54 31.5,7.49 31.75,6.99 31.75,5.97 30.48,4.83 SV_JTAG.3
JTAG_TMS
  Top 0.254: U1.14 35.84,12.34 34.04,12.19 32.13,10.29 32.13,7.62 33.02,6.22 SV_JTAG.5
MAIN_CURR_SENS  (via drill 0.6)
  Top 0.305: v44.07,31.5 46.48,28.96 46.48,27.94 v47.37,27.05 | 29.84,36.96 29.84,36.58 42.16,36.58 42.55,36.83 v43.43,36.83
  Top 0.406: U$1.3 29.02,36.96 29.84,36.96
  Bottom 0.305: v47.37,27.05 47.37,25.49 R5.2 | v43.43,36.83 43.43,32.89 v44.07,31.5
MAIN_PWR_IO
  Top 0.254: U1.40 39.34,24.66 38.99,25.02 37.72,25.02 36.7,26.04 36.7,26.67 35.05,26.67 34.8,26.92 U$14.5
MOT_IN1
  Top 0.406: R_MOT_IN.5 23.75,18.98 23.24,19.56 20.83,20.57 18.54,20.57 14.61,24.89 13.84,24.89 U2.5
MOT_IN2
  Top 0.406: R_MOT_IN.6 23.37,18.18 22.61,18.92 21.97,18.92 20.19,19.68 18.16,19.68 15.62,22.35 13.75,22.35 U2.7
MOT_IN3
  Top 0.254: 14.73,18.54 14.67,18.6 U2.10
  Top 0.406: R_MOT_IN.7 22.88,17.38 22.23,18.03 21.59,18.03 20.19,18.54 14.73,18.54
MOT_IN4
  Top 0.254: 14.73,16.13 14.54,16.06 U2.12
  Top 0.406: R_MOT_IN.8 22.99,16.51 22.1,15.82 21.39,15.82 19.94,16.13 14.73,16.13
MOT_O3_1
  Top 1.27: U2.14 6.28,13.52 JP13.1 D11.A D12.C
MOT_O3_2
  Top 1.016: U2.13 14.13,14.35 D13.C 16,14.35 D10.A
  Top 1.27: JP12.1 U2.13
MOT_O4_1
  Top 1.27: JP11.1 U2.3 D15.A D16.C
MOT_O4_2
  Top 1.27: JP10.1 6.16,29.4 U2.2 9.99,31.92 | D14.C 9.99,31.92 | 9.99,31.92 D9.A
MOT_PWR
  Top 0.254: R_PWR_FET1.1 31.51,46.13 C_MPWR_DEBOUNCE.1 | Q2.4 32.13,45.17 R_PWR_FET1.1 | R_PWR_FET1.1 30.14,45.97 R_PWR_FET.1
N$1  (via drill 0.6)
  Top 0.254: C_AVCC.2 44.46,20.04 U1.35 U1.34 40.87,19.53 v40.51,19.18
  Bottom 0.254: v40.51,19.18 42,19.18 R_ANA.2
N$2
  Top 0.305: U$2.2 47.3,24.51 R9.1
N$3
  Top 0.254: U1.6 30.23,18.03 29.28,18.98 R_MOT_IN.4
N$4  (via drill 0.6)
  Top 0.254: U1.12 31.55,15.04 v30.35,13.97 | v28.83,18.03 28.19,18.41 26.29,18.41 25.93,18.18 R_MOT_IN.3
  Bottom 0.254: v30.35,13.97 v28.83,18.03
N$5
  Top 0.305: U$15.1 56.13,19.56 57.15,18.54 57.15,17.65 57.91,17.27 58.78,17.27 IC6.14
  Top 0.406: R_SERVO1.2 62.87,15.62 61.34,17.14 IC6.14
N$6
  Top 0.305: U$15.2 56.13,17.14 57.28,16.76 57.28,16.38 57.78,15.88 IC6.15
  Top 0.406: IC6.15 60.83,15.88 R_SERVO2.2
N$7  (via drill 0.6)
  Top 0.305: R_PWR_FET1.2 36.58,46.23 37.59,45.21 40.26,45.21 41.66,43.81 41.66,40.51 v42.42,39.62 | v39.75,31.5 38.73,31.5 U$14.2
  Bottom 0.305: v42.42,39.62 42.42,38.99 40.64,36.83 40.77,32.38 v39.75,31.5
N$8
  Top 0.254: U1.8 29.97,17.02 29.34,16.64 26.29,16.64 25.55,17.38 R_MOT_IN.2
N$9
  Top 1.27: JP4.2 19.56,42.8
  Top 2.54: 19.56,42.8 20.19,42.8 F2.1A
N$10  (via drill 0.6)
  Top 0.406: V_SEL1.1 R13.2 | V_SEL2.1 50.76,0.64 47.75,0.64 | 47.75,0.64 45.21,0.64 44.36,1.23 | 47.79,0.8 47.75,0.64 | J1.3 44.72,4.84 45.09,4.95 v45.09,9.14
  Top 0.61: 44.36,1.23 R13.2 44.36,3.33 J1.3 | R12.2 47.79,0.8
  Bottom 0.406: v45.09,9.14 45.88,9.14 U$4.4
N$11
  Top 0.254: U1.9 30.25,16.54 29.59,16.13 26.04,16.13 25.58,16.58 R_MOT_IN.1
N$12
  Top 0.254: R_P3V3.2 49.53,49.28 46.99,49.28 45.97,48.51 LED_3V3.C
N$13
  Top 0.406: IC6.1 66.04,13.87 66.04,12.7 68.33,10.41 SV5.1
N$14
  Top 0.254: C5.1 C6.1 R14.1
N$15
  Top 0.406: IC6.2 66.17,15.88 66.67,15.11 67.06,14.1 SV5.2
N$16
  Top 0.254: U1.38 40.36,24.74 40.89,25.27 43.6,25.27 | R10.2 43.6,26.16 | C_ASIG3.1 43.6,26.16 | 43.6,26.16 43.6,25.27 | 43.6,25.27 R9.2
N$17
  Top 0.406: IC6.4 66.17,18.41 67.06,17.02 SV4.1
N$18
  Top 0.406: U$3.P$10 57.27,10.42 58.67,9.02 59.82,9.02 JP7.1
  Top 0.61: D7.A JP7.1
  Bottom 0.61: JP7.1 D7.A
N$19
  Top 0.406: IC6.5 66.55,19.68 SV4.2
N$20  (via drill 0.6)
  Top 0.305: v65.28,4.06 LED_5V_SERVO.C
  Bottom 0.305: R_P5V.2 v65.28,4.06
N$21
  Top 0.254: LED_PWR_EXT.C R_P_EXT.2
N$22
  Top 0.254: LED_PWR_MOT.C R_P_MOT.2
N$23
  Top 0.406: IC6.6 68.07,20.95 SV3.1
N$24
  Top 0.406: IC6.7 66.55,22.23 SV3.2
N$25  (via drill 0.6)
  Top 0.254: v42.8,22.1 42.22,21.89 U1.36
  Bottom 0.254: v42.8,22.1 44.03,22.1 R8.2 46.08,21.93 C_ASIG1.1 46.1,21.88 R7.1
N$26  (via drill 0.6)
  Top 0.254: v41.83,23.16 U1.37
  Bottom 0.254: R5.1 46.95,23.24 R6.2 | R6.2 46.13,23.25 C_ASIG2.1 | R6.2 45.99,23.16 43.31,23.16 42.8,23.24 v41.83,23.16
N$27
  Top 0.406: IC6.9 60.33,23.5 63.25,26.42 SV1.2
N$28
  Top 0.406: LED_PWR_BATT.C R_P_BATT.2
N$29
  Top 0.406: U$3.P$9 55.23,9.67 56.01,8.89 57.4,8.89 JP7.2
  Top 0.61: D5.A JP7.2
  Bottom 0.61: JP7.2 D5.A
N$30
  Top 0.406: U$3.P$8 54.23,9.4 JP7.3
  Top 0.61: D3.A JP7.3
  Bottom 0.61: JP7.3 D3.A
N$31
  Top 0.406: U$3.P$7 53.23,7.86 JP7.4
  Top 0.61: D1.A JP7.4
  Bottom 0.61: JP7.4 D1.A
N$32
  Top 0.406: IC6.10 60.96,22.23 63.75,25.02 69.09,25.02 SV1.1
N$33  (via drill 0.6)
  Top 0.305: R11.2 29.46,8.04 v29.59,6.6
  Bottom 0.305: v29.59,6.6 28.19,7.37 JP2.3
N$34  (via drill 0.6)
  Top 0.305: R1.2 27.56,7.91 v27.69,6.48
  Bottom 0.305: v27.69,6.48 25.91,4.83 JP2.2
N$35  (via drill 0.6)
  Top 0.254: U1.7 29.72,17.53 29.08,17.14 27.56,17.14 v26.8,17.53 | v26.8,14.99 R_MOT_ENABLE.1
  Bottom 0.254: v26.8,17.53 26.92,17.14 26.8,15.75 v26.8,14.99
N$36
  Top 0.254: U1.23 40.36,14.86 40.89,14.86 42.04,14.1 42.8,13.21 44.07,13.21 44.7,12.57 47.88,12.57 JP3.1
N$37  (via drill 0.6)
  Top 0.254: U1.21 39.34,14.71 39.62,15.11 39.88,15.62 v40.51,16 | v43.43,14.1 44.96,14.1 45.66,13.4 R15.4
  Bottom 0.254: v40.51,16 v43.43,14.1
N$38
  Top 0.254: U1.25 44.91,15.04 45.74,14.21
  Top 0.305: 45.74,14.21 R15.3
N$39
  Top 0.254: U1.26 45.31,15.52 45.83,15.01
  Top 0.305: 45.83,15.01 R15.2
N$40
  Top 0.254: U1.27 46.14,16.03
  Top 0.305: 46.14,16.03 R15.1
N$41  (via drill 0.6)
  Top 0.305: U$14.1 36.58,31.5 v37.21,31.5
  Bottom 0.305: v37.21,31.5 37.59,31.5 39.37,33.27 39.37,37.21 JP15.1
N$42
  Top 0.254: LED1.C 35.54,25.3 33.27,27.56 31.37,27.56 31.11,27.81 27.56,27.81 27.18,27.43 27.01,27.3 R_DEBUG1.2
N$43
  Top 0.254: LED2.C 30.57,26.29 R_DEBUG2.2
N$44  (via drill 0.6)
  Top 0.254: R14.2 38.61,9.31 38.61,10.17 C_CORE.1 37.85,11.42 U1.18 37.85,14.73 38.73,15.24 39.24,16.13 v40.26,17.27
  Bottom 0.254: v40.26,17.27 42.12,17.27 R_ANA.1
PWR_IO2
  Top 0.254: U1.39 39.85,24.92 39.24,25.53 37.97,25.53 37.34,26.16 37.34,27.05 36.96,27.3 U$14.3
RESET_N  (via drill 0.6)
  Top 0.254: v41.66,5.46 41.91,5.46 42.67,6.1 42.67,12.04 40.77,12.04 39.85,12.57 U1.22
  Bottom 0.254: v41.66,5.46 39.37,4.7 39.37,3.43 34.8,3.43 33.53,2.16 SV_JTAG.6
SERVO_TX1
  Top 0.254: U1.29 49.78,17.02
  Top 0.305: 49.78,17.02 52.07,18.41 53.34,19.68 U$15.5
SERVO_TX2
  Top 0.254: U1.28 50.19,16.54
  Top 0.305: 50.19,16.54 52.7,17.65 U$15.3
TWI_TWCK  (via drill 0.6)
  Top 0.254: U1.20 38.86,12.7 40.51,11.43 41.27,11.43 v41.53,11.18 | v45.72,11.3 47.75,10.75 47.88,5.21 48.72,4.49 J1.1
  Top 0.61: R12.1 49.49,2.91 J1.1
  Bottom 0.254: v41.53,11.18 42.04,11.3 v45.72,11.3 | U$4.1 48.72,6.05 J1.1
TWI_TWD
  Top 0.254: U1.24 40.84,12.62 41.4,12.57 43.69,12.57 44.96,10.16 46.61,10.14 J1.2
  Top 0.61: R13.1 46.06,3.02 J1.2
  Bottom 0.254: U$4.3 46.29,5.25 J1.2
USART3_RXD
  Top 0.254: U1.31 49.28,18.03
  Top 0.305: 49.28,18.03 51.69,20.45 51.69,22.01 R2.1
USART3_RXD_2  (via drill 0.6)
  Top 0.305: R2.2 52.32,25.78 54.23,26.16 55.88,27.77 v55.88,31.62 | v57.15,36.83 57.4,37.08 57.4,37.72 57.66,37.97 57.66,41.4 59.69,43.43 SV_EXT_UART.2
  Bottom 0.305: v55.88,31.62 55.88,35.56 v57.15,36.83
USART3_TXD
  Top 0.254: U1.30 49.53,17.53
  Top 0.305: 49.53,17.53 52.32,20.32 52.32,21.72 52.58,22.1 53.68,22.1 R3.1
USART3_TXD_2  (via drill 0.6)
  Top 0.305: R3.2 54.48,25.27 57.15,27.94 v57.15,31.62 | v58.42,36.83 58.42,40.64 59.31,41.53 SV_EXT_UART.3
  Bottom 0.305: v57.15,31.62 57.15,35.56 v58.42,36.83

### Text on the board
_tsilk: MOT PWR
_bsilk: GND / 5v / S0 S1 / / Gnd 5V Sgn / 2 3 / 4 5 / 6 7 | RobotBoard 2 / (c) Johannes, Sulkakoski, 2014, GPLv2 / johannes.sulkakoski@systemlive.fi | GND / RX / TX / 3v3